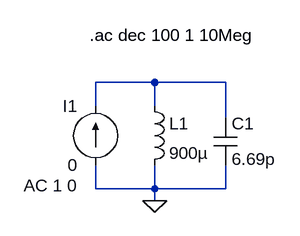
[diagram p0: schematic Draft1.asc]
Draft1.asc, the LTspice schematic file:
Version 4
SHEET 1 880 680
WIRE 192 80 112 80
WIRE 288 80 192 80
WIRE 112 112 112 80
WIRE 192 112 192 80
WIRE 288 128 288 80
WIRE 112 224 112 192
WIRE 192 224 192 192
WIRE 192 224 112 224
WIRE 288 224 288 192
WIRE 288 224 192 224
WIRE 192 240 192 224
FLAG 192 240 0
SYMBOL ind 176 96 R0
SYMATTR InstName L1
SYMATTR Value 900µ
SYMBOL cap 272 128 R0
SYMATTR InstName C1
SYMATTR Value 6.69p
SYMBOL current 112 192 R180
WINDOW 0 24 80 Left 2
WINDOW 3 24 0 Left 2
WINDOW 123 24 -28 Left 2
WINDOW 39 0 0 Left 0
SYMATTR InstName I1
SYMATTR Value 0
SYMATTR Value2 AC 1 0
TEXT 104 16 Left 2 !.ac dec 100 1 10Meg

The netlist it stands for:
* Draft1.asc
L1 N001 0 900µ
C1 N001 0 6.69p
I1 0 N001 0 AC 1 0
.ac dec 100 1 10Meg
.backanno
.end